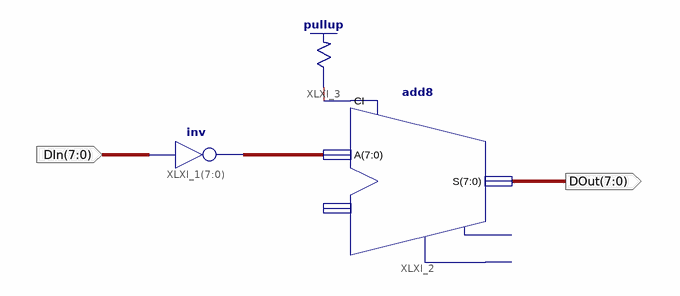
[diagram p0: schematic sheet 1]
// Xilinx ISE schematic Force2sComplement.sch (spartan3e) as structural Verilog: 3 symbols, 2 ports
module Force2sComplement (
  input  [7:0] DIn,
  output [7:0] DOut
);

  wire XLXN_3;
  wire [7:0] XLXN_2;

  assign XLXN_2 = ~DIn;  // inv XLXI_1[7..0], 8 bits wide
  add8 XLXI_2 (.A(XLXN_2), .CI(XLXN_3), .S(DOut));  // open: B, CO, OFL
  \pullup  XLXI_3 (.O(XLXN_3));
endmodule
